# EAGLE design ESP32_D1_Mini_Breakout (EAGLE 9.6.2)
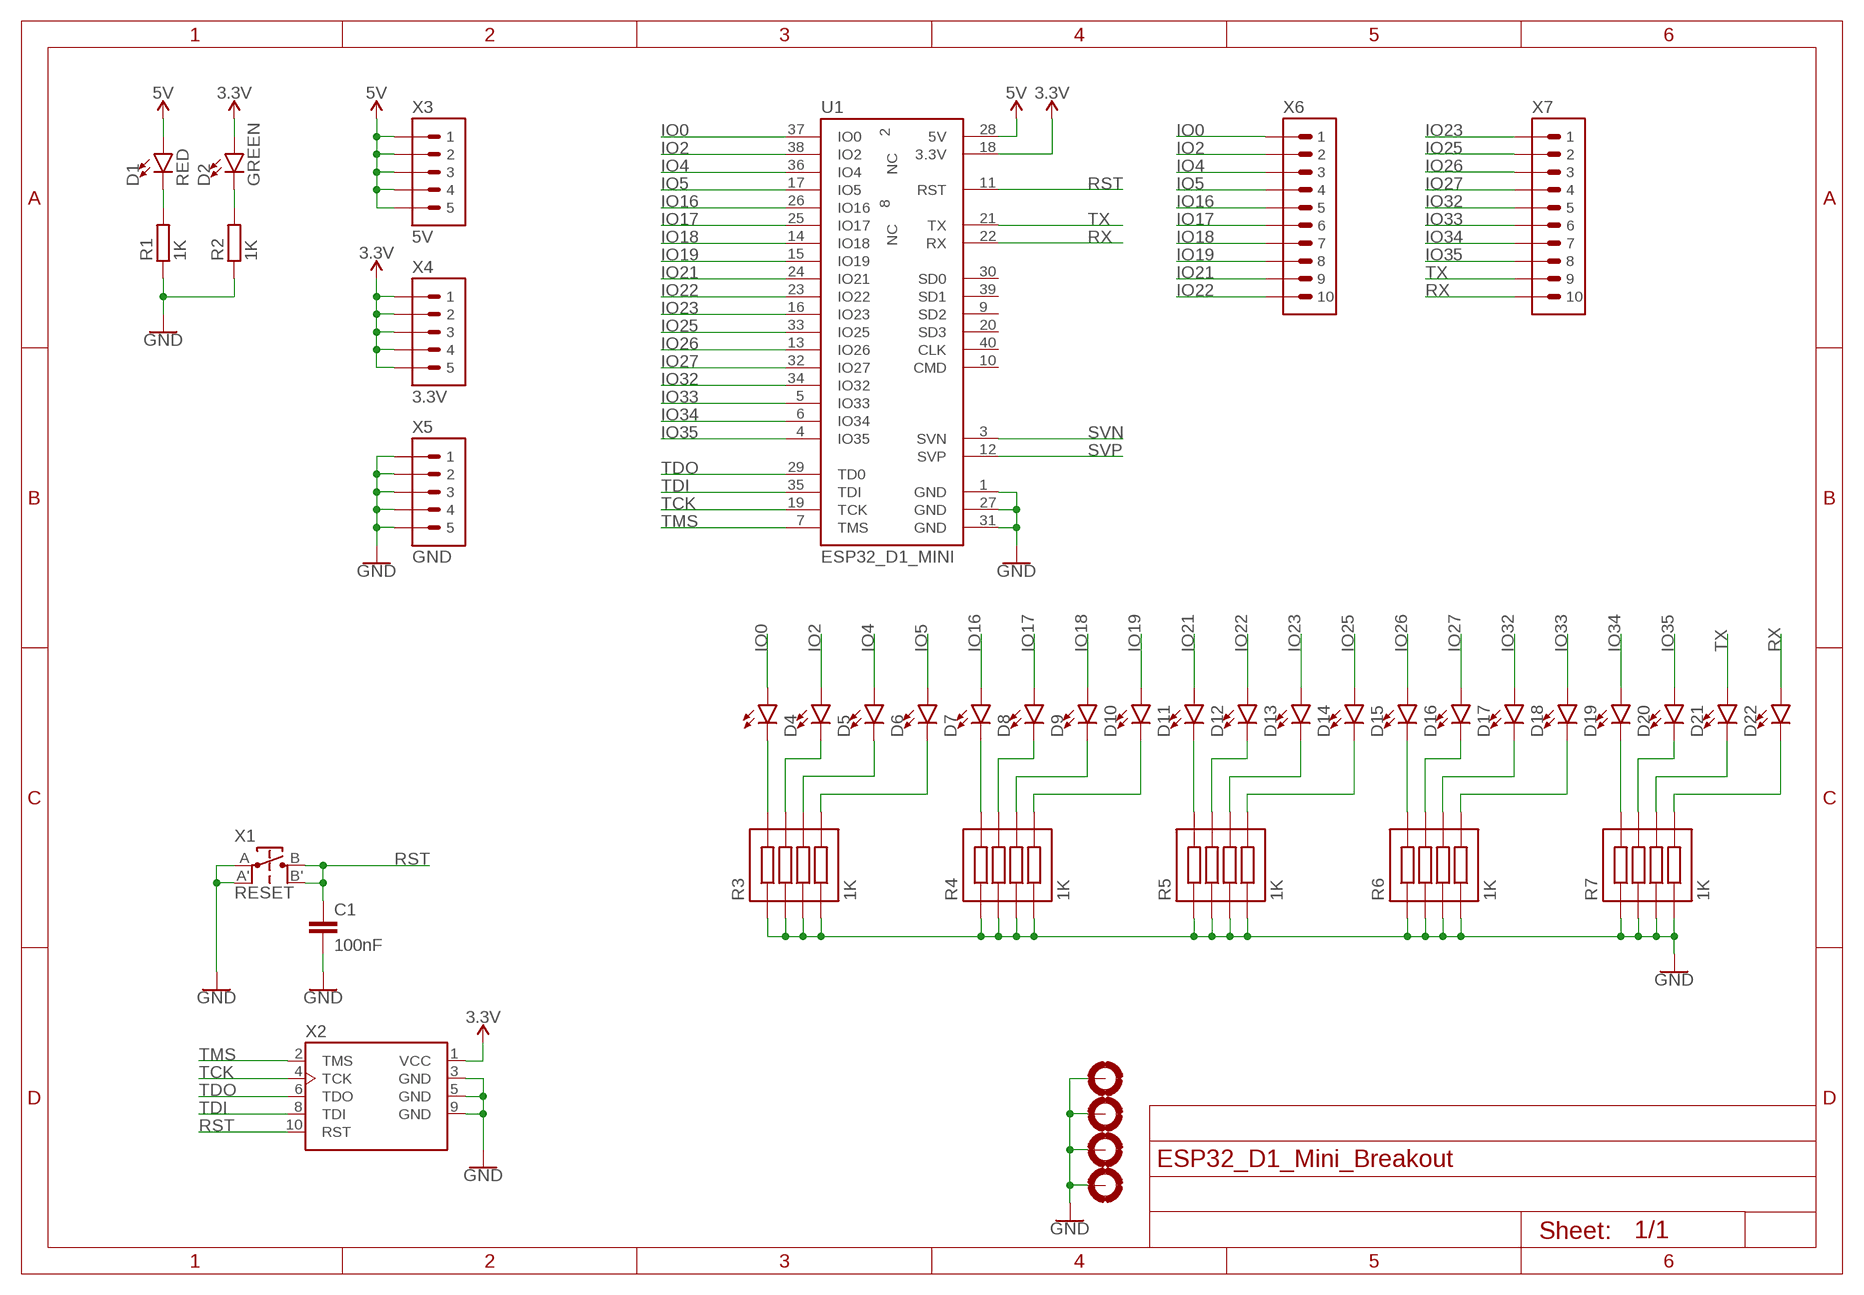
[diagram p0: schematic, sheet 1]

## Parts
C1  100nF  CAPC0603  [C0603]
D1  RED  LED0603  [LED0603]
D2  GREEN  LED0603  [LED0603]
D3  LED0603  [LED0603]
D4  LED0603  [LED0603]
D5  LED0603  [LED0603]
D6  LED0603  [LED0603]
D7  LED0603  [LED0603]
D8  LED0603  [LED0603]
D9  LED0603  [LED0603]
D10  LED0603  [LED0603]
D11  LED0603  [LED0603]
D12  LED0603  [LED0603]
D13  LED0603  [LED0603]
D14  LED0603  [LED0603]
D15  LED0603  [LED0603]
D16  LED0603  [LED0603]
D17  LED0603  [LED0603]
D18  LED0603  [LED0603]
D19  LED0603  [LED0603]
D20  LED0603  [LED0603]
D21  LED0603  [LED0603]
D22  LED0603  [LED0603]
H1  MOUNTHOLE-PAD3.2  [3.2-PAD]
H2  MOUNTHOLE-PAD3.2  [3.2-PAD]
H3  MOUNTHOLE-PAD3.2  [3.2-PAD]
H4  MOUNTHOLE-PAD3.2  [3.2-PAD]
R1  1K  RESISTOR0603  [R0603]
R2  1K  RESISTOR0603  [R0603]
R3  1K  RESISTOR-ARRAY-X41206  [RX4_1206]
R4  1K  RESISTOR-ARRAY-X41206  [RX4_1206]
R5  1K  RESISTOR-ARRAY-X41206  [RX4_1206]
R6  1K  RESISTOR-ARRAY-X41206  [RX4_1206]
R7  1K  RESISTOR-ARRAY-X41206  [RX4_1206]
U1  ESP32_D1_MINI  WEMOS_ESP32_D1_MINI  [WEMOS_ESP32_D1_MINI]
X1  RESET  TACT-SWITCHEVQ  [TACT-SWITCH-EVQ]
X2  ESP32-JTAGTH  [2X05-1.27-SWD]
X3  5V  HEADER-1X05-2.54  [1X05-2.54]
X4  3.3V  HEADER-1X05-2.54  [1X05-2.54]
X5  GND  HEADER-1X05-2.54  [1X05-2.54]
X6  HEADER-1X10-2.54  [1X10-2.54]
X7  HEADER-1X10-2.54  [1X10-2.54]

## Nets
3.3V: D2.A U1.18(3.3V) X2.1(VCC) X4.1 X4.2 X4.3 X4.4 X4.5
5V: D1.A U1.28(5V) X3.1 X3.2 X3.3 X3.4 X3.5
GND: C1.2 H1.B3,2(MOUNT) H2.B3,2(MOUNT) H3.B3,2(MOUNT) H4.B3,2(MOUNT) R1.1 R2.1 R3.1 R3.3 R3.5 R3.7 R4.1 R4.3 R4.5 R4.7 R5.1 R5.3 R5.5 R5.7 R6.1 R6.3 R6.5 R6.7 R7.1 R7.3 R7.5 R7.7 U1.1(GND) U1.27(GND) U1.31(GND) X1.A X1.A' X2.3(GND) X2.5(GND) X2.9(GND) X5.1 X5.2 X5.3 X5.4 X5.5
IO0: D3.A U1.37(IO0) X6.1
IO2: D4.A U1.38(IO2) X6.2
IO4: D5.A U1.36(IO4) X6.3
IO5: D6.A U1.17(IO5) X6.4
IO16: D7.A U1.26(IO16) X6.5
IO17: D8.A U1.25(IO17) X6.6
IO18: D9.A U1.14(IO18) X6.7
IO19: D10.A U1.15(IO19) X6.8
IO21: D11.A U1.24(IO21) X6.9
IO22: D12.A U1.23(IO22) X6.10
IO23: D13.A U1.16(IO23) X7.1
IO25: D14.A U1.33(IO25) X7.2
IO26: D15.A U1.13(IO26) X7.3
IO27: D16.A U1.32(IO27) X7.4
IO32: D17.A U1.34(IO32) X7.5
IO33: D18.A U1.5(IO33) X7.6
IO34: D19.A U1.6(IO34) X7.7
IO35: D20.A U1.4(IO35) X7.8
N$1: D2.C R2.2
N$2: D1.C R1.2
N$3: D6.C R3.8
N$4: D5.C R3.6
N$5: D4.C R3.4
N$6: D3.C R3.2
N$7: D7.C R4.2
N$8: D8.C R4.4
N$9: D9.C R4.6
N$10: D10.C R4.8
N$11: D11.C R5.2
N$12: D12.C R5.4
N$13: D13.C R5.6
N$14: D14.C R5.8
N$15: D15.C R6.2
N$16: D16.C R6.4
N$19: D18.C R6.8
N$20: D17.C R6.6
N$21: D19.C R7.2
N$22: D20.C R7.4
N$23: D21.C R7.6
N$24: D22.C R7.8
RST: C1.1 U1.11(RST) X1.B X1.B' X2.10(RST)
RX: D22.A U1.22(RX) X7.10
SVN: U1.3(SVN)
SVP: U1.12(SVP)
TCK: U1.19(TCK) X2.4(TCK)
TDI: U1.35(TDI) X2.8(TDI)
TDO: U1.29(TD0) X2.6(TDO)
TMS: U1.7(TMS) X2.2(TMS)
TX: D21.A U1.21(TX) X7.9
Unconnected: U1.2(NC) U1.8(NC) U1.9(SD2) U1.10(CMD) U1.20(SD3) U1.30(SD0) U1.39(SD1) U1.40(CLK)

## Library data of the parts
C1 = M2M-Passives:CAP
D1-D22 = M2M-LED:LED: LED (Generic) Standard schematic elements and footprints for 5mm, 3mm, 1206, and 0603 sized LEDs. Generic LEDs with no color specified.
H1-H4 = M2M-Holes:MOUNTHOLE-PAD
R1 R2 = M2M-Passives:RESISTOR
R3-R7 = M2M-Passives:RESISTOR-ARRAY-X4
U1 = M2M-Modules:WEMOS_ESP32_D1_MINI
X1 = M2M-Switches:TACT-SWITCH
X2 = M2M-Connectors:ESP32-JTAG
X3-X5 = M2M-Connectors:HEADER-1X05-2.54
X6 X7 = M2M-Connectors:HEADER-1X10-2.54

## Board
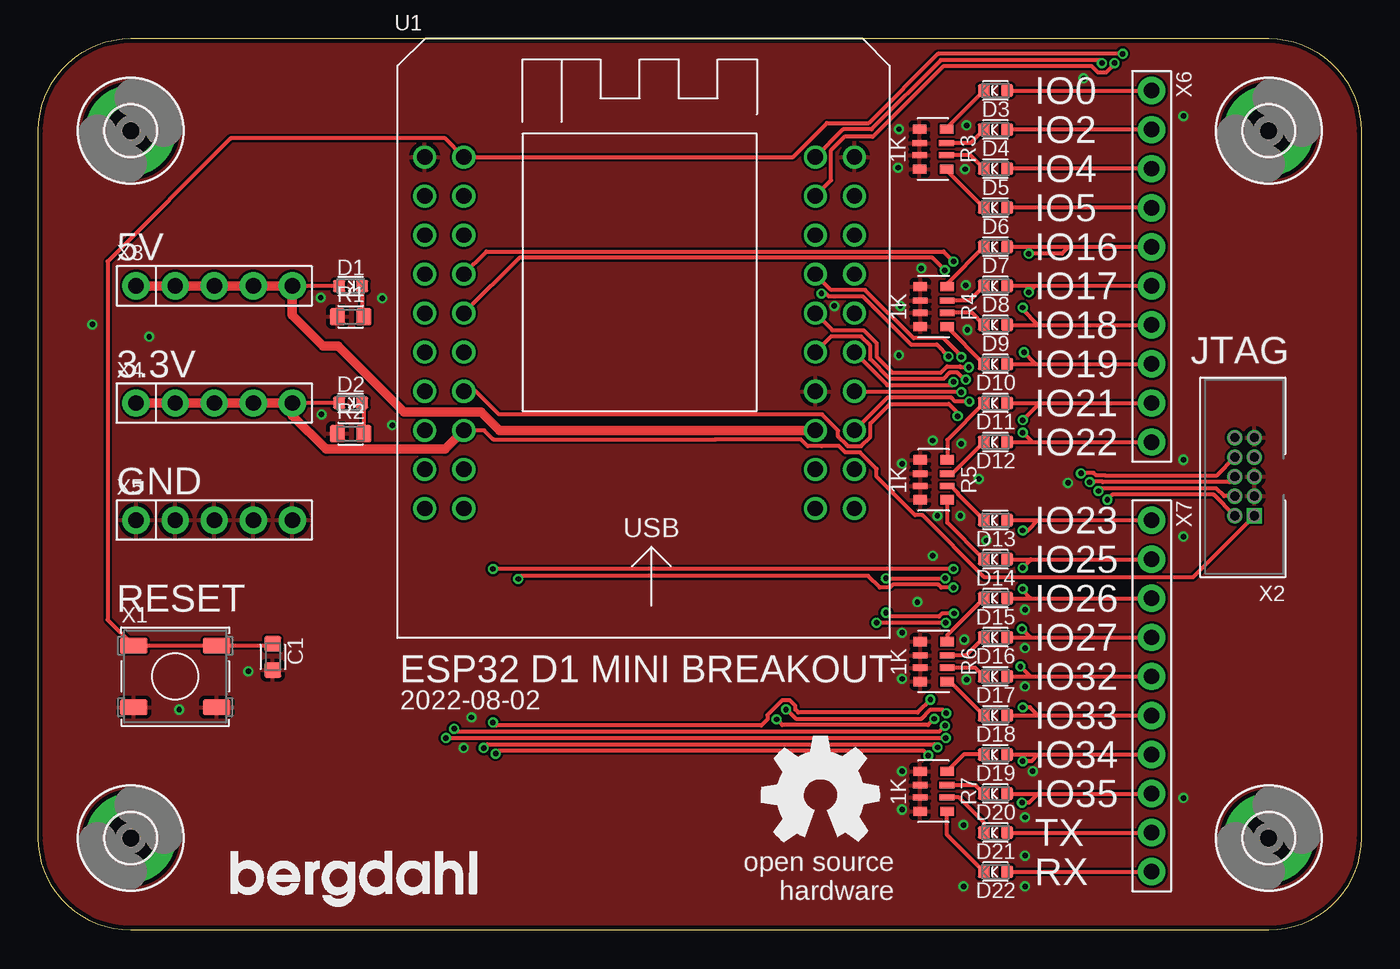
[diagram p1: board, top side]
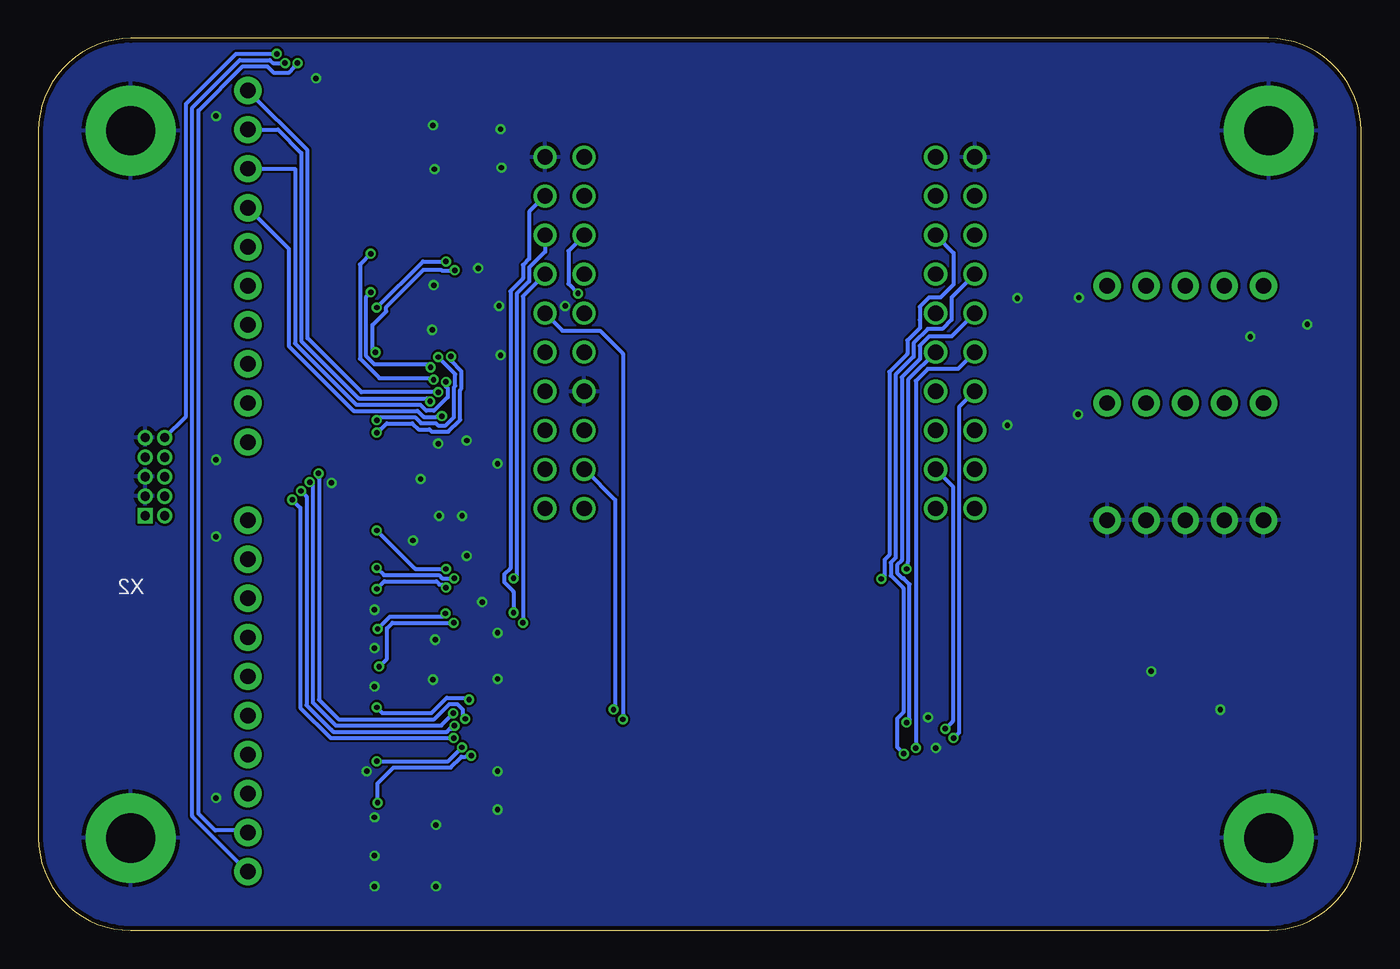
[diagram p2: board, bottom side, seen from below]

Size 86 x 58 mm. Coordinates in mm from the lower left corner, seen from the top.
Outline: 80,0 6,0 arc-90 0,6 0,52 arc-90 6,58 80,58 arc-90 86,52 86,6 arc-90 80,0
Copper layers (1*16): Top 0.035mm / dielectric 1.5mm / Bottom 0.035mm
Design rules "SeeedStudio_2layer_DRU_no_angle_20140221": minimum track width 6mil, minimum drill 0.3mm, track to track 6mil, track to pad 6mil, pad to pad 6mil, via to via 6mil, smd to smd 0mil, copper to edge 10mil, drill to drill 10mil, minimum pad ring 2mil, minimum via ring 6mil, stop-mask expansion 2mil, vias tented up to drill 1000mil, thermal gap 10mil

### Footprints (pad centres in the part's own frame; a part is rotated, then mirrored left to right if it is on the bottom)
C0603 = smd 1 x 1.1: 1 -0.85,0; 2 0.85,0
LED0603 = smd 0.8 x 0.8: A -0.75,0; C 0.75,0
3.2-PAD = drill 3.2 pad 5.842: B3,2 0,0
R0603 = smd 1 x 1.1: 1 -0.85,0; 2 0.85,0
RX4_1206 = smd 0.6 x 0.875: 1 -1.3,-0.875; 2 -1.3,0.875; 7 1.3,-0.875; 8 1.3,0.875 | smd 0.4 x 0.95: 3 -0.4,-0.875; 4 -0.4,0.875; 5 0.4,-0.875; 6 0.4,0.875
WEMOS_ESP32_D1_MINI = drill 1: 1 0,22.86; 2 0,20.32; 3 0,17.78; 4 0,15.24; 5 0,12.7; 6 0,10.16; 7 0,7.62; 8 0,5.08; 9 0,2.54; 10 0,0; 11 2.54,22.86; 12 2.54,20.32; 13 2.54,17.78; 14 2.54,15.24; 15 2.54,12.7; 16 2.54,10.16; 17 2.54,7.62; 18 2.54,5.08; 19 2.54,2.54; 20 2.54,0; 21 25.4,22.86; 22 25.4,20.32; 23 25.4,17.78; 24 25.4,15.24; 25 25.4,12.7; 26 25.4,10.16; 27 25.4,7.62; 28 25.4,5.08; 29 25.4,2.54; 30 25.4,0; 31 27.94,22.86; 32 27.94,20.32; 33 27.94,17.78; 34 27.94,15.24; 35 27.94,12.7; 36 27.94,10.16; 37 27.94,7.62; 38 27.94,5.08; 39 27.94,2.54; 40 27.94,0
TACT-SWITCH-EVQ = smd 1.8 x 1: A -2.7,-2; A' 2.7,-2; B -2.7,2; B' 2.7,2
2X05-1.27-SWD = drill 0.6 pad 1 square: 1 0,0 | drill 0.6 pad 1: 2 1.27,0; 3 0,-1.27; 4 1.27,-1.27; 5 0,-2.54; 6 1.27,-2.54; 7 0,-3.81; 8 1.27,-3.81; 9 0,-5.08; 10 1.27,-5.08
1X05-2.54 = drill 1 pad 1.778: 1 0,0; 2 2.54,0; 3 5.08,0; 4 7.62,0; 5 10.16,0
1X10-2.54 = drill 1 pad 1.778: 1 0,0; 2 2.54,0; 3 5.08,0; 4 7.62,0; 5 10.16,0; 6 12.7,0; 7 15.24,0; 8 17.78,0; 9 20.32,0; 10 22.86,0

### Placement (x,y rotation side)
C1  15.24,17.78 270 top
D1  20.3,41.9 0 top
D2  20.3,34.3 0 top
D3  62.23,54.61 180 top
D4  62.23,52.07 180 top
D5  62.23,49.53 180 top
D6  62.23,46.99 180 top
D7  62.23,44.45 180 top
D8  62.23,41.91 180 top
D9  62.23,39.37 180 top
D10  62.23,36.83 180 top
D11  62.23,34.29 180 top
D12  62.23,31.75 180 top
D13  62.23,26.67 180 top
D14  62.23,24.13 180 top
D15  62.23,21.59 180 top
D16  62.23,19.05 180 top
D17  62.23,16.51 180 top
D18  62.23,13.97 180 top
D19  62.23,11.43 180 top
D20  62.23,8.89 180 top
D21  62.23,6.35 180 top
D22  62.23,3.81 180 top
H1  6,6 0 top
H2  80,6 0 top
H3  6,52 0 top
H4  80,52 0 top
R1  20.3,39.9 0 top
R2  20.3,32.3 0 top
R3  58.17,50.8 270 top
R4  58.21,40.56 270 top
R5  58.21,29.29 270 top
R6  58.21,17.48 270 top
R7  58.2,9.04 270 top
U1  25.12,27.43 0 top
U$3  [BERGDAHL-20MM-TPLACE]  12.49,1.54 0 top
U$4  [OSHW-8MM-TPLACE]  50.83,8.79 0 top
X1  8.89,16.51 0 top
X2  79.06,26.96 180 top
X3  6.35,41.91 0 top
X4  6.35,34.29 0 top
X5  6.35,26.67 0 top
X6  72.39,54.61 270 top
X7  72.39,26.67 270 top

### Tracks (layer width: path | path; a pad name or v marks a point on that pad's centre or on a via)
3.3V
  Top 0.254: X4.5 D2.A | X2.1 75.06,22.96 61.51,22.96 57.47,27 57,27 54.5,29.5 54.5,30 53.42,31.08 52.46,31.08 52.04,31.5 50.96,31.5 50.94,31.48 50.02,31.48 49.57,31.93 44.07,31.93 44,31.93 29.57,31.93 28.99,32.51 U1.18
  Top 0.61: X4.1 X4.2 X4.3 X4.4 X4.5 16.51,33.49 18.71,31.29 26.44,31.29 U1.18
5V
  Top 0.254: X3.5 D1.A
  Top 0.61: U1.28 29.99,32.51 28.78,33.72 23.78,33.72 19.5,38 18.5,38 16.5,40 X3.5 X3.4 X3.3 X3.2 X3.1
GND  (via drill 0.35)
  other vias: 56.15,19.35 57.15,21.35 58.15,24.35 56.15,30.35 58.15,31.85 61.15,29.35 61.65,25.35 64.15,20.85 64.15,18.35 64.15,15.85 64.65,10.35 64.15,7.35 60.15,6.85 64.15,2.85 64.15,4.85 60.15,2.85 56.15,10.35 56.15,7.85 56.15,16.35 58.45,26.95 55.95,37.4 56.05,40.6 57.4,43.05 60.4,39.05 60.3,41.95 60,31.65 59.95,26.95 60.2,18.9 60.35,16.3 27.65,11.85 28.15,13.85 13.65,16.85 9.15,14.35 18.4,33.55 23,32.85 18.35,41.15 22.35,41.1 7.2,38.6 3.5,39.4 51.75,40.6 55.95,52.1 55.9,49.6 60.35,52.35 60.25,49.5 67.95,55.4 74.45,52.95 66.95,29.1 74.45,30.6 74.45,25.6 74.45,8.6
  pour Bottom: 0,58 86,58 86,0 0,0
  pour Top: 0,58 86,58 86,0 0,0
IO0  (via drill 0.35)
  Top 0.254: D3.A X6.1 | U1.37 59.95,35.05 v60,35
  Bottom 0.254: v60,35 65,35 68.5,38.5 68.5,50.72 X6.1
IO2  (via drill 0.35)
  Top 0.254: X6.2 D4.A | U1.38 55.19,34.65 59.35,34.65 59.61,34.39 v60.53,34.39
  Bottom 0.254: X6.2 70.42,52.07 68.91,50.55 68.91,38.33 65.17,34.59 60.73,34.59 v60.53,34.39
IO4  (via drill 0.35)
  Top 0.254: X6.3 D5.A | U1.36 55.19,35.46 59.3,35.46 v59.5,35.66
  Bottom 0.254: X6.3 69.31,49.53 69.31,38.16 65.34,34.19 61.19,34.19 60.79,33.79 60.28,33.79 59.39,34.68 59.39,35.25 59.5,35.36 v59.5,35.66
IO5  (via drill 0.35)
  Top 0.254: X6.4 D6.A | U1.17 28.45,35.05 29.96,33.54 50.96,33.54 52,32.5 52,32.11 52.56,31.56 52.63,31.48 53.48,31.48 54.09,32.09 54.09,32.97 55.36,34.24 59.19,34.24 59.77,33.65 v59.77,33.44
  Bottom 0.254: X6.4 69.72,44.32 69.72,37.99 65.5,33.78 61.35,33.78 60.95,33.38 60.12,33.38 60.05,33.44 v59.77,33.44
IO16  (via drill 0.35)
  Top 0.254: D7.A 67,44.45 | 67,44.45 X6.5 | 67,44.45 66.55,44 v64.39,44 | v60.31,35.81 60.21,35.81 59.75,36.27 59.25,36.27 58.85,35.87 55.36,35.87 54.09,37.14 54.09,38.02 53.48,38.62 51.55,38.62 U1.26
  Bottom 0.254: v64.39,44 65.09,43.3 65.09,37.17 63.83,35.91 60.41,35.91 v60.31,35.81
IO17  (via drill 0.35)
  Top 0.254: X6.6 64.8,41.91 | 64.8,41.91 D8.A | 64.8,41.91 v64.39,41.5 | U1.25 51.62,39.03 53.65,39.03 54.5,38.18 54.5,37.3 55.53,36.27 58.68,36.27 59.08,36.67 59.92,36.67 59.98,36.61 v60.5,36.61
  Bottom 0.254: v64.39,41.5 64.69,41.21 64.69,37.34 64.16,36.81 60.7,36.81 v60.5,36.61
IO18  (via drill 0.35)
  Top 0.254: D9.A 65,39.37 | 65,39.37 X6.7 | v64,40.5 64,40.37 65,39.37 | U1.14 29.14,44.15 58.85,44.15 v59.5,43.5
  Bottom 0.254: v64,40.5 61,43.5 v59.5,43.5
IO19  (via drill 0.35)
  Top 0.254: D10.A 64.84,36.83 | 64.84,36.83 X6.8 | 64.84,36.83 v64.08,37.59 | v58.93,42.93 58.11,43.74 31.27,43.74 U1.15
  Bottom 0.254: v64.08,37.59 64.28,37.79 64.28,39.36 63.39,40.25 63.39,40.53 60.96,42.96 59.82,42.96 59.75,42.89 59.25,42.89 59.21,42.93 v58.93,42.93
IO21  (via drill 0.35)
  Top 0.254: D11.A 65,34.29 | 65,34.29 X6.9 | U1.24 51.55,41.64 53.76,41.64 56.9,38.5 58.86,38.5 59.79,37.57 59.79,37.49 v60,37.28 | 65,34.29 65,34.17 v64,33.17
  Bottom 0.254: v64,33.17 63.8,33.37 61.52,33.37 61.12,32.97 60.16,32.97 60.02,32.83 59.52,32.83 58.99,33.37 58.99,35.31 58.89,35.41 58.89,36.17 v60,37.28
IO22  (via drill 0.35)
  Top 0.254: D12.A 64.62,31.75 | 64.62,31.75 X6.10 | v50.92,41.42 51.2,41.42 51.38,41.24 53.59,41.24 56.73,38.09 58.41,38.09 v59.18,37.32 | 64.62,31.75 v64,32.37
  Bottom 0.254: U1.23 51.55,44.18 51.55,42.05 v50.92,41.42 | v64,32.37 63.8,32.57 63.75,32.57 63.35,32.97 61.69,32.97 61.29,32.57 60.57,32.57 60.43,32.43 59.35,32.43 58.58,33.2 58.58,35.15 58.49,35.24 58.49,36.34 59.18,37.03 v59.18,37.32
IO23  (via drill 0.35)
  Top 0.254: D13.A 65,26.67 | 65,26.67 X7.1 | 65,26.67 64.33,26 v64,26 | v59.5,23.5 v29.56,23.5
  Bottom 0.254: U1.16 29.45,35.8 29.45,24 29.45,23.61 v29.56,23.5 | v64,26 61.5,23.5 v59.5,23.5
IO25  (via drill 0.35)
  Top 0.254: D14.A 64.5,24.13 | 64.5,24.13 X7.2 | 64.5,24.13 64.5,24.07 v64,23.57 | v55.11,22.89 v58.97,22.89
  Bottom 0.254: v64,23.57 63.52,23.09 59.95,23.09 59.75,22.89 v58.97,22.89 | U1.33 53.06,44.13 54.09,43.1 54.09,42.22 54.91,41.4 54.91,23.09 v55.11,22.89
IO26  (via drill 0.35)
  Top 0.254: D15.A 64.5,21.59 | 64.5,21.59 X7.3 | 64.5,21.59 64,22.09 v64,22.2 | v59.5,22.29 58.71,22.29 58.51,22.49 55.56,22.49 55.36,22.29 54.71,22.29 53.95,23.05 31.4,23.05 v31.2,22.85
  Bottom 0.254: U1.13 26.5,44.05 26.5,42 27.34,41.16 28.08,41.16 28.69,40.56 28.69,39.71 28.68,39.7 28.68,39.18 29.5,38.35 29.5,37.47 30.67,36.3 30.67,24.39 30.98,24.09 30.98,23.07 v31.2,22.85 | v64,22.2 63.51,22.69 60.12,22.69 59.92,22.49 59.7,22.49 v59.5,22.29
IO27  (via drill 0.35)
  Top 0.254: D16.A 64.5,19.05 | 64.5,19.05 X7.4 | 64.5,19.05 v63.95,19.6 | v55.11,20.66 55.36,20.41 58.55,20.41 58.75,20.6 v59.53,20.6 v59.54,20.61
  Bottom 0.254: U1.32 54.09,46.72 54.09,43.67 54.49,43.27 54.49,42.39 55.31,41.57 55.31,23.55 55.71,23.14 55.71,22.64 55.11,22.04 v55.11,20.66 | v63.95,19.6 63.15,20.4 59.74,20.4 v59.54,20.61
IO32  (via drill 0.35)
  Top 0.254: D17.A 64.5,16.51 | 64.5,16.51 X7.5 | 64.5,16.51 v63.86,17.15 v63.85,17.15 | v59,19.99 v58.99,20 v54.5,20
  Bottom 0.254: U1.34 54.5,41.23 v54.5,20 | v63.85,17.15 63.34,17.66 63.34,19.63 62.98,19.99 v59,19.99
IO33  (via drill 0.35)
  Top 0.254: D18.A 65,13.97 | 65,13.97 X7.6 | 65,13.97 64.47,14.5 v64,14.5 | v58,15 57.16,14.16 49.41,14.16 49.21,14.36 49.21,14.61 48.86,14.96 48.35,14.96 47.39,14 47.39,13.71 47,13.31 29.76,13.31 v29.56,13.51
  Bottom 0.254: U1.5 26.63,38.62 28.08,38.62 28.69,38.02 28.69,37.17 28.67,37.15 29.86,35.97 29.86,24.06 30.16,23.75 30.16,23.25 29.81,22.89 29.75,22.89 29.36,22.5 29.36,13.71 v29.56,13.51 | v64,14.5 63.64,14.14 60.44,14.14 59.45,15.13 58.13,15.13 v58,15
IO34  (via drill 0.35)
  Top 0.254: D19.A 65,11.43 | 65,11.43 X7.7 | 65,11.43 64.57,11 v64,11 | v28.95,11.85 29.19,12.09 58.27,12.09 v58.47,11.89
  Bottom 0.254: U1.6 26.21,36.5 28.18,36.5 28.95,35.73 v28.95,11.85 | v64,11 59.36,11 v58.47,11.89
IO35  (via drill 0.35)
  Top 0.254: D20.A 65,8.89 | 65,8.89 X7.8 | 65,8.89 64.41,8.3 v63.95,8.3 | v29.73,11.49 29.93,11.69 57.53,11.69 v57.86,11.36
  Bottom 0.254: U1.4 26.63,41.16 26.63,39.71 27.23,39.1 28.18,39.1 29.09,38.19 29.09,37.31 30.26,36.14 30.26,24.23 30.57,23.92 30.57,23.07 29.76,22.26 29.76,14.17 30.16,13.77 30.16,11.92 v29.73,11.49 | v63.95,8.3 63.95,9.55 62.91,10.59 59.19,10.59 58.5,11.29 58.21,11.29 58.14,11.36 v57.86,11.36
N$1
  Top 0.254: D2.C 21.15,34.2 R2.2
N$2
  Top 0.254: D1.C 21.05,40 R1.2
N$3
  Top 0.254: D6.C 59.04,49.43 R3.8
N$4
  Top 0.254: D5.C 60.61,50.4 R3.6
N$5
  Top 0.254: D4.C 60.61,51.2 R3.4
N$6
  Top 0.254: D3.C 59.04,52.17 R3.2
N$7
  Top 0.254: D7.C 59.09,42.06 R4.2
N$8
  Top 0.254: D8.C 60.53,40.96 R4.4
N$9
  Top 0.254: D9.C 60.69,40.16 R4.6
N$10
  Top 0.254: D10.C 59.09,39.22 R4.8
N$11
  Top 0.254: D11.C 59.09,31.9 R5.2
N$12
  Top 0.254: D12.C 59.42,29.69 R5.4
N$13
  Top 0.254: D13.C 59.81,28.34 59.81,28.41 59.32,28.89 R5.6
N$14
  Top 0.254: D14.C 59.09,26.52 R5.8
N$15
  Top 0.254: D15.C 59.09,19.2 R6.2
N$16
  Top 0.254: D16.C 60.31,17.88 R6.4
N$19
  Top 0.254: D18.C 59.27,16.18 R6.8
N$20
  Top 0.254: D17.C 60.91,17.08 R6.6
N$21
  Top 0.254: D19.C 60.16,11.43 R7.2
N$22
  Top 0.254: D20.C 60.93,9.44 R7.4
N$23
  Top 0.254: D21.C 61.48,6.98 61.5,7 59.86,8.64 R7.6
N$24
  Top 0.254: D22.C 59.07,6.22 R7.8
RST  (via drill 0.35)
  Top 0.254: C1.1 15.12,18.51 X1.B' X1.B 4.5,20.2 4.5,43.5 12.5,51.5 26.45,51.5 U1.11 49.06,50.29 51.27,52.5 54,52.5 58.5,57 v70.5,57
  Bottom 0.254: X2.10 76.41,33.42 76.41,53.75 73.15,57 v70.5,57
RX  (via drill 0.35)
  Top 0.254: D22.A X7.10 | U1.22 51.55,48.78 51.55,50.75 52.4,51.6 54.25,51.6 58.84,56.19 68.51,56.19 68.91,55.79 69.41,55.79 69.77,56.14 69.77,56.19 v69.97,56.39
  Bottom 0.254: X7.10 76,7.42 76,53.5 72.91,56.59 70.95,56.59 70.75,56.39 v69.97,56.39
TCK  (via drill 0.35)
  Top 0.254: X2.4 77.09,28.23 76.58,28.75 69.1,28.75 v68.93,28.57 | v27.04,13.11 27.23,12.91 58.55,12.91 v58.95,13.31
  Bottom 0.254: U1.19 26.55,28.87 26.55,13.59 v27.04,13.11 | v68.93,28.57 68.56,28.21 68.56,14.64 66.96,13.04 66.84,12.92 | 66.84,12.92 66.83,12.91 | v58.95,13.31 59.15,13.11 59.25,13.11 59.44,12.92 66.84,12.92
TDI  (via drill 0.35)
  Top 0.254: X2.8 76.58,29.56 69.38,29.56 69.35,29.58 68.77,29.58 68.61,29.75 67.82,29.75 v67.79,29.71 | v48,13.71 48.36,13.35 57.85,13.35 v58.25,13.75
  Bottom 0.254: U1.35 51.93,39 49.5,39 48,37.5 v48,13.71 | v67.79,29.71 67.79,29.43 67.75,29.39 67.75,15 66.48,13.73 60.27,13.73 59.28,14.72 58.78,14.72 58.42,14.37 58.42,13.92 v58.25,13.75
TDO  (via drill 0.35)
  Top 0.254: v48.61,14.36 48.64,14.36 49.24,13.76 57.4,13.76 58,14.36 58.78,14.36 v59.03,14.11 | v68.36,29.14 68.64,29.14 68.68,29.18 69.18,29.18 69.21,29.15 77.44,29.15 X2.6
  Bottom 0.254: U1.29 50.47,29.97 48.5,28 48.5,14.46 v48.61,14.36 | v68.36,29.14 68.16,28.94 68.16,14.81 66.67,13.32 59.82,13.32 v59.03,14.11
TMS  (via drill 0.35)
  Top 0.254: X2.2 76.41,28.34 69.84,28.34 v69.5,28 | v26.5,12.5 v59,12.5
  Bottom 0.254: v59,12.5 67,12.5 68.97,14.47 68.97,27.47 v69.5,28 | U1.7 26.15,34.02 26.15,12.85 v26.5,12.5
TX  (via drill 0.35)
  Top 0.254: D21.A X7.9 | U1.21 52.32,52.09 54.17,52.09 58.67,56.59 68.96,56.59 v69.16,56.39
  Bottom 0.254: X7.9 72.54,6.5 74.5,6.5 75.59,7.59 75.59,53.31 72.71,56.19 71.12,56.19 70.72,55.79 69.71,55.79 69.36,56.14 69.36,56.19 v69.16,56.39

### Text on the board
tPlace: IO0 | IO2 | IO4 | IO5 | 5V | IO16 | IO17 | IO18 | 3.3V | IO19 | JTAG | IO21 | IO22 | GND | IO23 | IO25 | RESET | IO26 | IO27 | ESP32 D1 MINI BREAKOUT | IO32 | 2022-08-02 | IO33 | IO34 | IO35 | TX | RX